# Altium schematic sheet Accelerometer.SchDoc: Accelerometer Schematic
size A; Author: Jason Popich; Engineer: Jason Popich; Organization: GAINS; DocumentNumber: N/A; Revision: 001; SheetNumber: 3; SheetTotal: 4
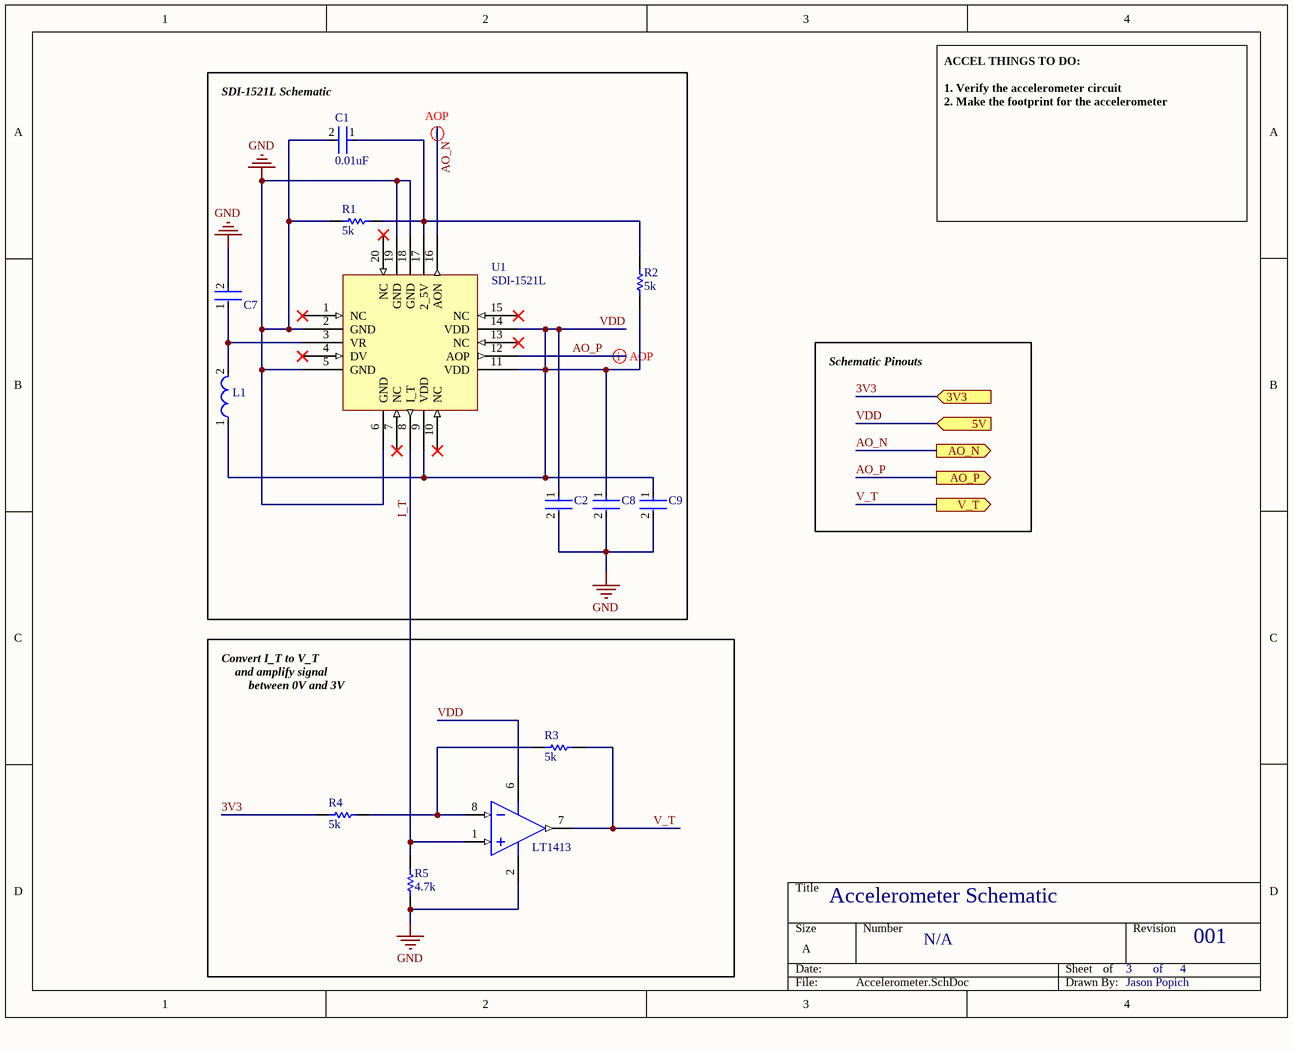
[diagram p0: Accelerometer.SchDoc]

## Parts
C1  0.01uF  [FP-GCM21B-0_15-IPC_C]
C2  GJ821BR71H105KA12L  [FP-GJ821B-0_1-MFG]  (value not drawn)
C7  KRM55QR71H106KH01K  [FP-KRM55Q-6_1_5_3_3_9_1_2-MFG]  (value not drawn)
C8  GJ821BR71H105KA12L  [FP-GJ821B-0_1-MFG]  (value not drawn)
C9  GJ821BR71H105KA12L  [FP-GJ821B-0_1-MFG]  (value not drawn)
L1  LBM2016T330J  [FP-LBM2016-1_6-0_2-IPC_B]  (value not drawn)
R1  5k  [RESC2013X50X30ML20T20]
R2  5k  [RESC2013X50X30ML20T20]
R3  5k  [RESC2013X50X30ML20T20]
R4  5k  [RESC2013X50X30ML20T20]
R5  4.7k  [RESC2013X60X30ML20T20]
U1  SDI-1521L  [SDI 1521L]
U2  LT1413  [LT-S8-8_M]  (part A of 2)

## Blocks framed on the sheet
SDI-1521L Schematic: C1 C2 C7-C9 L1 R1 R2 U1

## Ports
3V3 (in, see Main_Sheet[3C], Gyroscope[4B], Microcontroller[4B]), 5V (in, see Main_Sheet[3C], Microcontroller[4B]), AO_N (out, see Main_Sheet[3C], Microcontroller[4C]), AO_P (out, see Main_Sheet[3C], Microcontroller[4C]), V_T (out, see Main_Sheet[3C], Microcontroller[4C])

## Nets
GND: C1.2 C2.2 C7.2 C8.2 C9.2 R1.2 R5.1 U1.2(GND) U1.5(GND) U1.6(GND) U1.18(GND) U1.19(GND) U2.2(V-)
3V3: R4.2 ; port 3V3
AO_N: U1.16(AON) ; port AO_N
AO_P: U1.12(AOP) ; port AO_P
I_T: R5.2 U1.8(I_T) U2.1(+IN_A)
V_T: R3.1 U2.7(OUT_A) ; port V_T
VDD: C2.1 C8.1 C9.1 L1.1 R2.1 U1.9(VDD) U1.11(VDD) U1.14(VDD) U2.6(V+) ; port 5V
NetC1_1: C1.1 R1.1 R2.2 U1.17(2_5V)
NetC7_1: C7.1 L1.2 U1.3(VR)
NetR3_2: R3.2 R4.1 U2.8(-IN_A)

Not connected (* = marked no-connect by the designer): U1 1(NC)* 4(DV)* 7(NC)* 10(NC)* 13(NC)* 15(NC)* 20(NC)*

## Layout directives
differential pair: AO_N, AO_P

## Notes on the sheet
- ACCEL THINGS TO DO:
  1. Verify the accelerometer circuit
  2. Make the footprint for the accelerometer
- Schematic Pinouts
- Convert I_T to V_T
- and amplify signal
- between 0V and 3V
- of

## Library data of the parts
C1 = CMP-06035-043554-1: Ceramic Capacitor for Automotive 10nF ±1% 50VDC X8G 0805 Embossed T/R (GCM21B5G1H103FA16K)
C2 C8 C9 = CMP-06035-063015-1: CAP CER 1UF 50V X7R 0805; Tolerance: 10%; Dielectric: X7R; Length: 2mm; Voltage Rating (DC): 50V; Case/Package: 0805; Max Operating Temperature: 125°C; Min Operating Temperature: -55°C; Capacitance: 1uF; Depth: 1.25mm; Packaging: Tape and Reel
C7 = CMP-06035-058109-1: Cap Ceramic 10uF 50V X7R ±10% SMD 2220 +125°C Emboss T/R; ESR (Equivalent Series Resistance): 100MR; Dissipation Factor: 0.05%; Length: 0.24inch; Termination: SMD/SMT; Thickness: 0.154inch; Case/Package: SMD/SMT; Mount: Surface Mount; Voltage Rating: 50V; Height: 3.7mm; Width: 0.209inch; Package Quantity: 1; Voltage Rating (DC): 50V; Capacitance: 10uF; Min Operating Temperature: -55°C; Tolerance: 10%; Max Operating Temperature: 125°C; Packaging: Tape and Reel
L1 = CMP-14484-001407-1: SMD Inductors 33uH ±5% 0.125A 4.68Ω 0806; Test Frequency: 2.52MHz; Current Rating: 125mA; Core Material: Ferrite; DC Resistance (DCR): 3.6R; Shielding: Unshielded; Self Resonant Frequency: 15MHz; Depth: 1.8mm; Radiation Hardening: No; Series: LB; Case/Package: 0806; Case Code (Imperial): 0806; Package Quantity: 2000; Tolerance: 5%; Lead Free: Lead Free; Mount: Surface Mount; Resistor Type: Wirewound; Packaging: Tape and Reel; Termination: SMD/SMT; Max DC Current: 125mA; Inductance: 33uH; Height: 1.6mm; Height - Seated (Max): 0.071inch; Length: 2mm; DC Current: 125mA; Halogen Free: Halogen Free; Max Operating Temperature: 105°C; RoHS Compliant: Yes; Min Operating Temperature: -40°C; Width: 0.063inch; Case Code (Metric): 2016; Military Standard: Not
R1-R4 = CMP-2001-04239-1: CRCW08055K00FKTA; Manufacturer: Vishay Dale; Part Number: CRCW08055K00FKTA
R5 = CMP-2001-02407-1: RK73H2ATTD4701F; Manufacturer: KOA Speer; Part Number: RK73H2ATTD4701F
U1 = SDI1521L: SDI1521L Accelerometer +/- 2G
U2 = CMP-0359-02913-2: Dual Channel, Precision Single Supply Operational Amplifier, 0.95 MHz Typical GBW, 0.3 V/us Typical SR, 3 to 22 V, 8-Pin SOIC (S8-8), Commercial, Pb-Free, Reel; Manufacturer: Linear Technology; PartNumber: LT1413S8#TRPBF; Vos (mV) Typical: 0.05; Vs Min (V): 3; SR (V/us) Typical: 0.3; Vs Max (V): 22; Is (mA) Typical: 0.33; Channels (#): 2; GBW (MHz) Typical: 0.95; RoHS: Pb-Free; RevisionNote: URLs updated; ComponentLink2Description: Datasheet; ComponentLink3Description: Package Specification; DatasheetVersion: Rev. 0; PackageVersion: Rev G; ComponentLink2URL: http://cds.linear.com/docs/en/datasheet/lt1413.pdf; PackageDescription: 8-Pin Plastic Small Outline, Body 4.9 x 3.9 mm, Pitch 1.27 mm; ComponentLink3URL: http://cds.linear.com/docs/en/packaging/05081610_G_SO8.pdf; ComponentLink1URL: http://www.linear.com/; PackageReference: LT-S8-8; Packing: Reel; Type: VFB; Linear Technology Part Number: LT1413; ComponentLink1Description: Manufacturer URL; Mounting Technology: Surface Mount